# EAGLE design neopixel-controller (EAGLE 9.2.2)
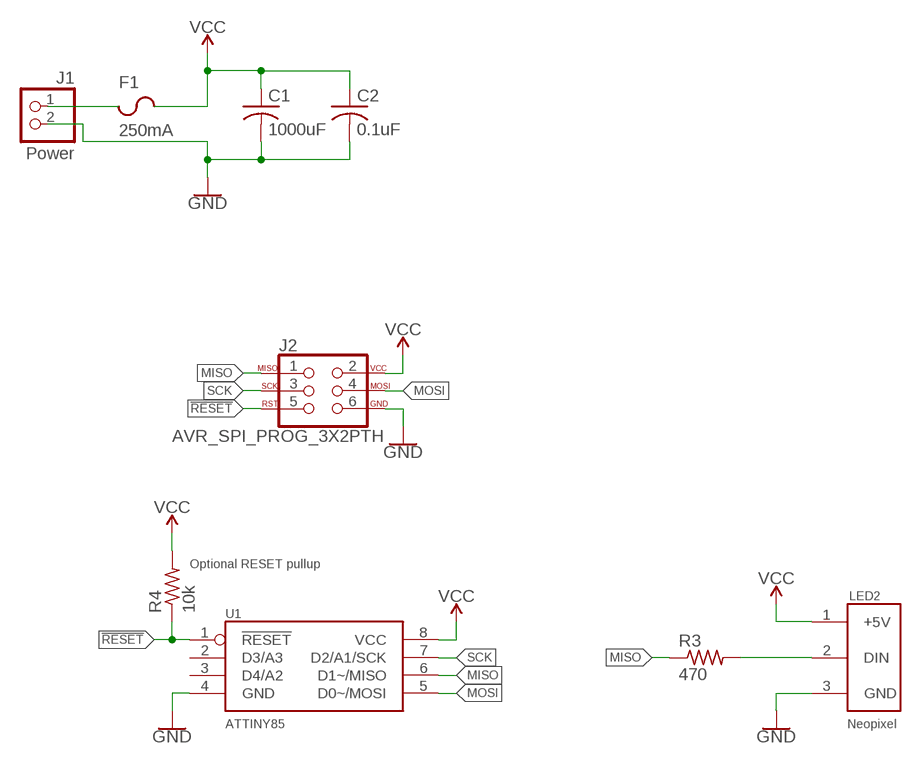
[diagram p0: schematic, sheet 1]

## Parts
C1  1000uF  CAPACITOR  [CAP-3,5-8]
C2  0.1uF  C-USC0805  [C0805]
F1  250mA  FUSE  [F1206]
J1  Power  PINHD-1X2  [1X02]
J2  AVR_SPI_PROG_3X2PTH  [2X3]
LED2  Neopixel  NEOPIXEL0.100_PINHEAD  [NEOPIXEL_PINHEAD]
R3  470  R-US_R0805  [R0805]
R4  10k  R-US_R0805  [R0805]
U1  ATTINY85  [8S2]

## Nets
!RESET!: J2.5 R4.1 U1.1(!RESET!)
GND: C1.NEGATIVE C2.2 J1.2 J2.6 LED2.3(GND) U1.4(GND)
MISO: J2.1 R3.1 U1.6(D1~/MISO)
MOSI: J2.4 U1.5(D0~/MOSI)
N$1: LED2.2(DIN) R3.2
N$2: F1.1 J1.1
SCK: J2.3 U1.7(D2/A1/SCK)
VCC: C1.POSITIVE C2.1 F1.2 J2.2 LED2.1(+5V) R4.2 U1.8(VCC)
Unconnected: U1.2(D3/A3) U1.3(D4/A2)

## Notes on the sheet
- Optional RESET pullup

## Library data of the parts
C1 = JoshCustom:CAPACITOR
C2 = resistor:C-US: CAPACITOR, American symbol
F1 = JoshCustom:FUSE
J1 = pinhead:PINHD-1X2: PIN HEADER
J2 = SparkFun-Connectors:AVR_SPI_PROG_3X2: AVR ISP 6 Pin This is the reduced ISP connector for AVR programming. Common on Arduino. This footprint will take up less PCB space and can be used with a 10-pin to 6-pin adapter such as SKU: BOB-08508 **Special note about "TEST_POINT" package. The stop mask is on the top side, so if you want your programming test points to be on the bottom of your board, make sure to place this package on the bottom side of the board. This also ensure that the orientation to program from the bottom side will be correct. SparkFun Products: SparkFun ISP Pogo Adapter <https://www.sparkfun.com/products/11591> - NS Tiny AVR Programmer <https://www.sparkfun.com/products/11801> -PTH
LED2 = JoshCustom:NEOPIXEL: Connector for a Neopixel strip
R3 R4 = resistor:R-US_: RESISTOR, American symbol
U1 = JoshCustom:ATTINY85: ATTiny85 microcontroller

## Net classes
0 default: clearance 0.205 mm

## Board
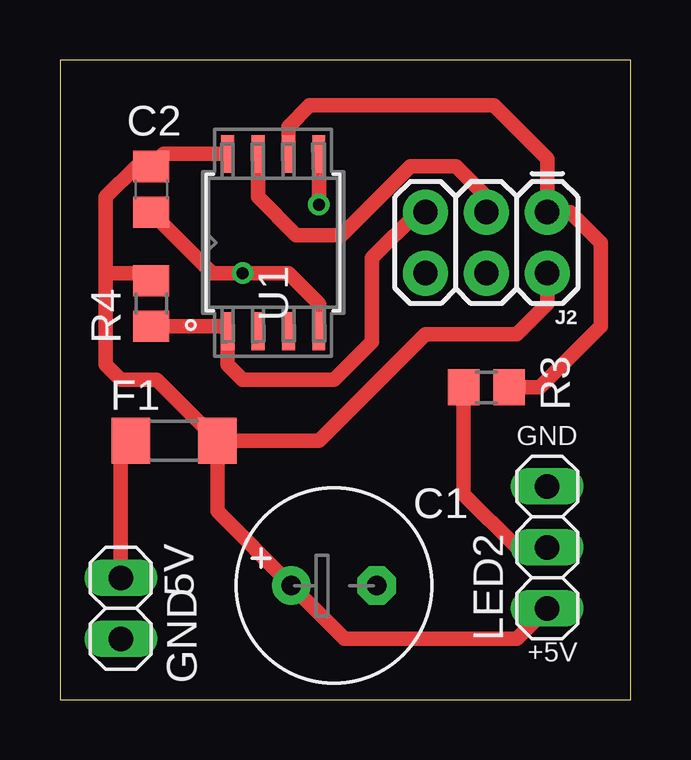
[diagram p1: board, top side]
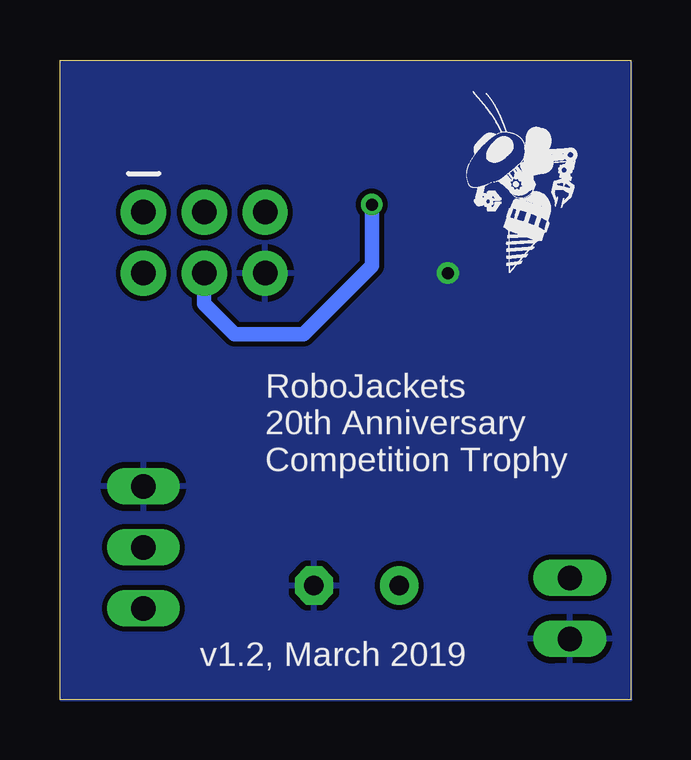
[diagram p2: board, bottom side, seen from below]

Size 23.8 x 26.66 mm. Coordinates in mm from the lower left corner, seen from the top.
Outline: 0,0 23.8,0 23.8,26.66 0,26.66 0,0
Copper layers (1*16): Top 0.0356mm / dielectric 63mil / Bottom 0.0356mm
Design rules "RJ2LayerDRU": minimum track width 6mil, minimum drill 15mil, track to track 6mil, track to pad 6mil, pad to pad 6mil, via to via 6mil, smd to smd 6mil, copper to edge 0mil, drill to drill 6mil, minimum pad ring 10mil, minimum via ring 8mil, stop-mask expansion 4mil, vias tented up to drill 0mil, thermal gap 10mil

### Footprints (pad centres in the part's own frame; a part is rotated, then mirrored left to right if it is on the bottom)
CAP-3,5-8 = drill 0.813 pad 1.6 octagon: NEGATIVE 1.778,0 | drill 0.813 pad 1.6: POSITIVE -1.778,0
C0805 = smd 1.3 x 1.5: 1 -0.95,0; 2 0.95,0
F1206 = smd 1.6 x 1.905: 1 -1.8,0; 2 1.8,0
1X02 = drill 1.016 long: 1 -1.27,0; 2 1.27,0
2X3 = drill 1.016 pad 1.88: 1 0,0; 2 0,2.54; 3 2.54,0; 4 2.54,2.54; 5 5.08,0; 6 5.08,2.54
NEOPIXEL_PINHEAD = drill 1.016 long: 1 -2.54,0; 2 0,0; 3 2.54,0
R0805 = smd 1.3 x 1.5: 1 -0.95,0; 2 0.95,0
8S2 = smd 1.575 x 0.533: 1 -3.696,1.905; 2 -3.696,0.635; 3 -3.696,-0.635; 4 -3.696,-1.905; 5 3.696,-1.905; 6 3.696,-0.635; 7 3.696,0.635; 8 3.696,1.905

### Placement (x,y rotation side)
C1  11.43,4.76 0 top
C2  3.81,21.27 270 top
F1  4.76,10.79 0 top
J1  2.54,3.81 270 top
J2  20.32,20.32 180 top
LED2  20.32,6.35 90 top
R3  17.78,13.02 180 top
R4  3.81,16.51 90 top
U1  8.89,19.05 90 top
U$1  [ROBOBUZZ_0.4X]  5.08,17.78 0 bottom

### Tracks (layer width: path | path; a pad name or v marks a point on that pad's centre or on a via)
!RESET!
  Top 0.61: R4.1 6.78,15.56 U1.1 6.99,13.97 7.62,13.34 11.43,13.34 13.02,14.92 13.02,18.41 14.92,20.32 J2.5
GND  (via drill 0.5)
  Top 0.61: C2.2 6.35,17.78 v7.62,17.78 9.53,17.78 10.79,16.51 U1.4
  pour Bottom: 0,0 23.75,0 23.75,26.54 0,26.54
MISO
  Top 0.61: R3.1 20,13.02 22.54,15.56 22.54,19.05 21.27,20.32 J2.1 20.32,22.54 18.1,24.77 10.4,24.77 9.53,23.89 U1.6
MOSI  (via drill 0.5)
  Top 0.61: U1.5 v10.79,20.64
  Bottom 0.61: v10.79,20.64 10.79,18.1 13.65,15.24 16.51,15.24 17.78,16.51 J2.4
N$1
  Top 0.61: R3.2 16.83,8.57 19.05,6.35 LED2.2
N$2
  Top 0.61: J1.1 2.54,10.37 F1.1
SCK
  Top 0.61: U1.7 8.26,20.95 9.84,19.37 11.75,19.37 14.61,22.23 16.51,22.23 17.78,20.95 J2.3
VCC
  Top 0.61: F1.2 6.56,7.85 C1.POSITIVE 11.87,2.54 19.05,2.54 LED2.1 | U1.8 4.33,22.75 C2.1 3.17,22.22 1.91,20.95 1.91,17.78 | F1.2 4.02,13.34 2.54,13.34 1.91,13.97 1.91,17.78 | R4.2 3.49,17.78 1.91,17.78 | F1.2 10.79,10.79 15.24,15.24 19.05,15.24 20.32,16.51 J2.2

### Text on the board
tPlace: 5V | GND
bPlace: RoboJackets / 20th Anniversary / Competition Trophy | v1.2, March 2019